# Altium schematic sheet LED Driver.SchDoc
size A; SheetNumber: 4; SheetTotal: 4
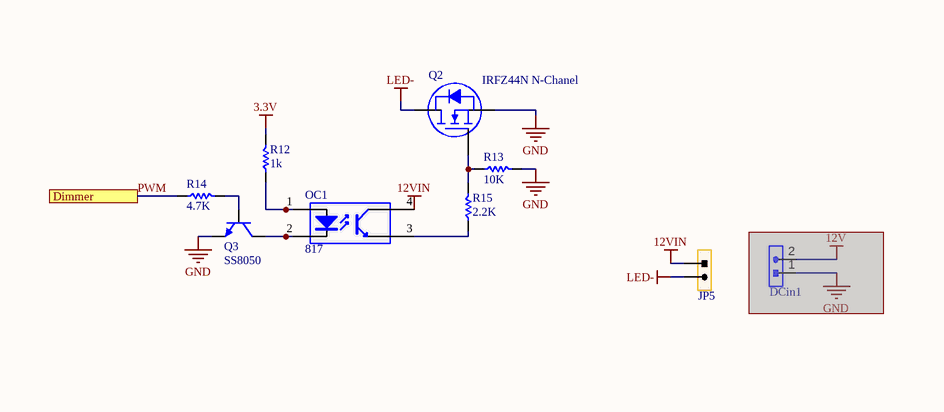
[diagram p0: LED Driver.SchDoc]

## Parts
DCin1  HDR-1X2  [KF2EDGK-2P_5.08]  (value not drawn)  (masked out: inside a compile mask, not in the netlist)
JP5  HDR-1X2  [KF381GR-2]  (value not drawn)
OC1  817  [PC817-SMD]
Q2  IRFZ44N N-Chanel  [TO263-3B]
Q3  SS8050  [SOT23-3N]
R12  1k  [R 0805]
R13  10K  [R 0805]
R14  4.7K  [R 0805]
R15  2.2K  [R 0805]

## Ports
Dimmer

## Nets
3.3V: R12.2
12VIN: JP5.1 OC1.4(C)
GND: Q2.3(S) Q3.2(E) R13.2
LED-: JP5.2 Q2.2(D)
PWM: R14.1 ; port Dimmer
NetOC1_1: OC1.1(A) R12.1
NetOC1_2: OC1.2(K) Q3.3(C)
NetOC1_3: OC1.3(E) R15.1
NetQ2_1: Q2.1(G) R13.1 R15.2
NetQ3_1: Q3.1(B) R14.2

## Library data of the parts
DCin1 JP5 = Header 2: 2P Connector; BOM名称: 2P接插件; 版权归属: 源创客; 学习资源: www.ooocke.com
OC1 = 817: AC Input Photocoupler; BOM名称: 线性光耦; 版权归属: 源创客; 学习资源: www.ooocke.com
Q2 = IRFZ44N
Q3 = 8050-SMD: High frequency amplification-NPN; BOM名称: 高频放大-NPN型; 版权归属: 源创客; 属性: 40V 1.5A 1W 100MHZ; 学习资源: www.ooocke.com
R12-R15 = R: Chip resistor; 版权归属: 源创客; BOM名称: Chip resistor; 学习资源: www.ooocke.com